# EAGLE design nextflex (EAGLE 9.5.2)

## Sheet 1 of 3
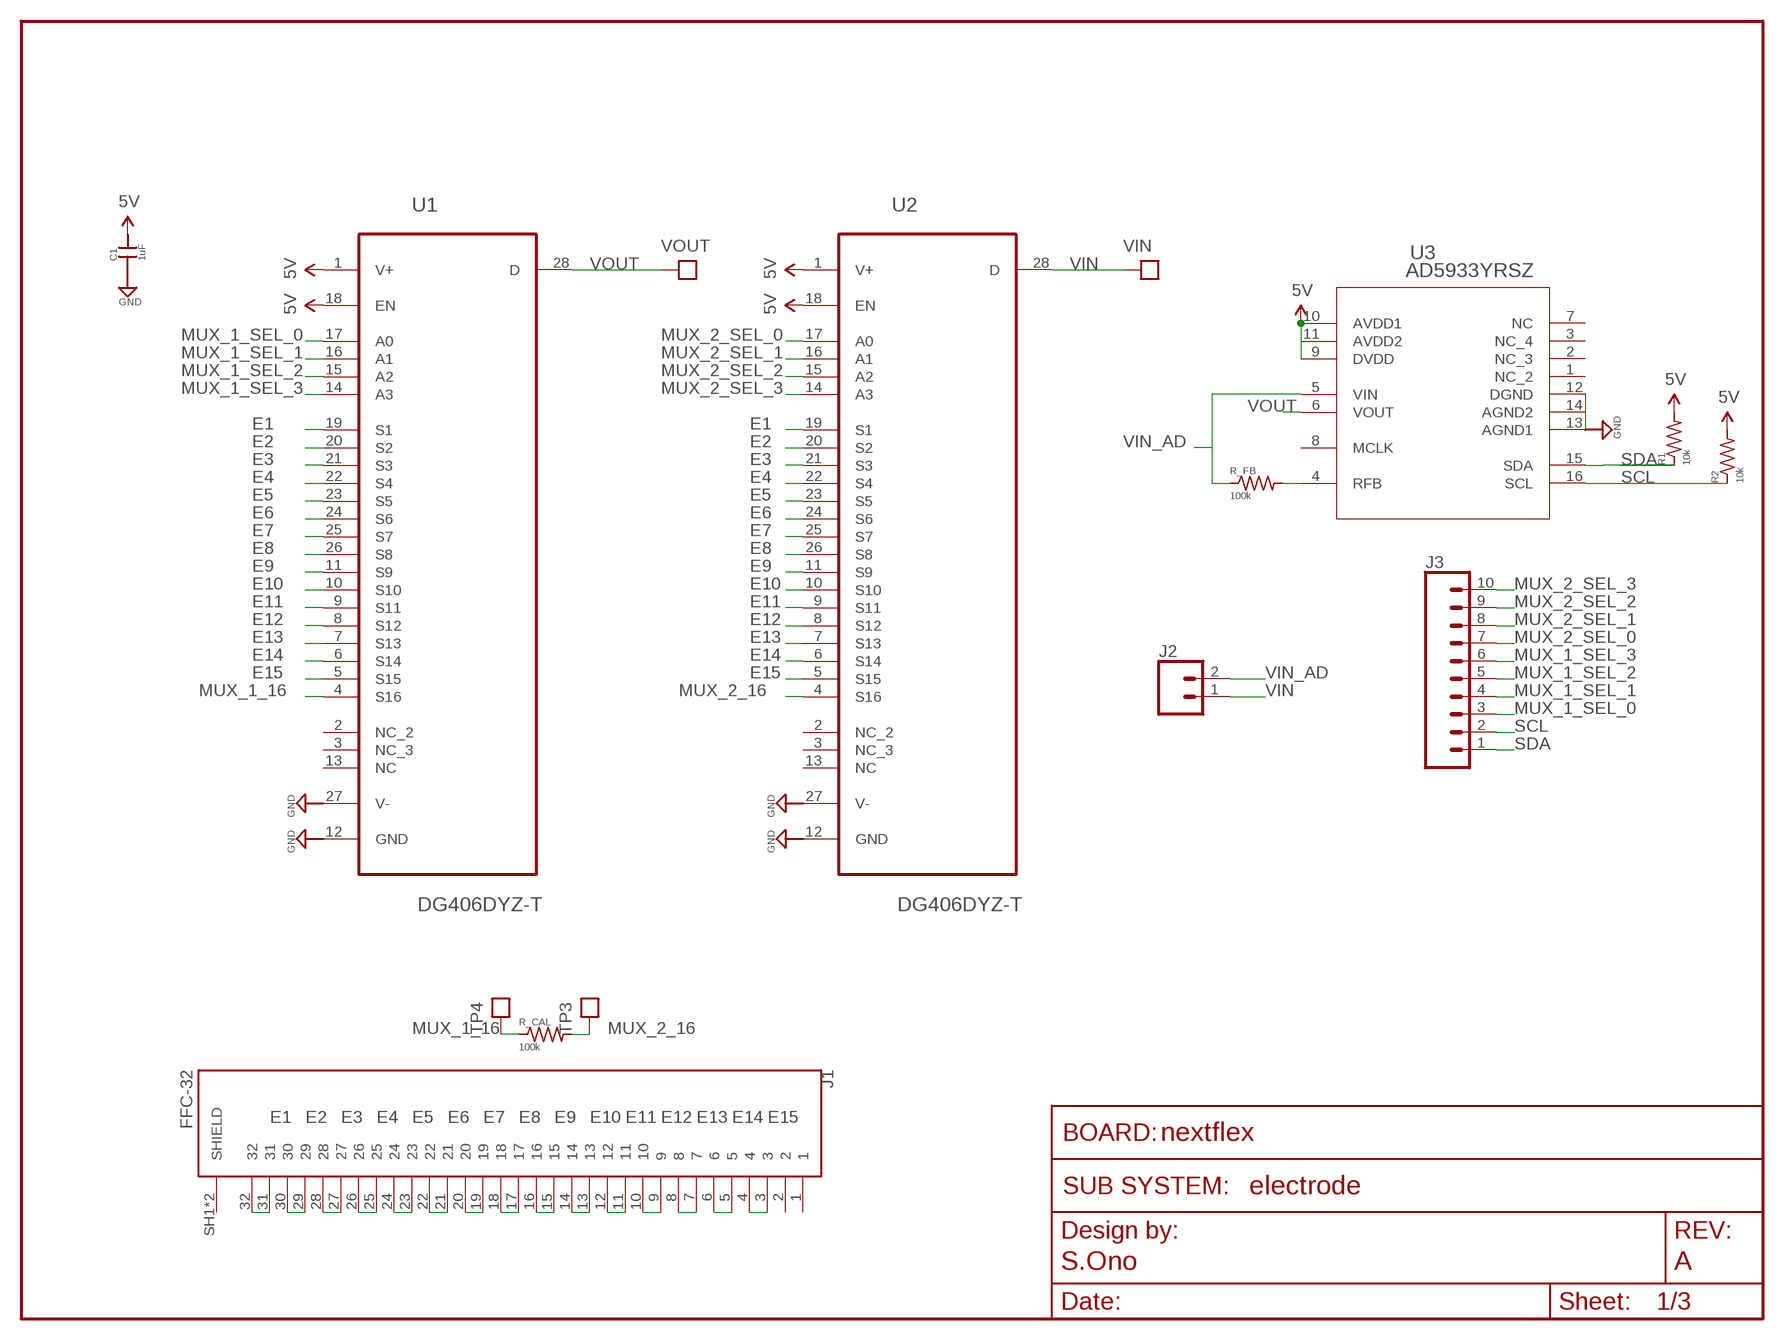
[diagram p0: schematic, sheet 1]
FRAME2 (FRAME_SCHEMATIC): AUTHOR: S.Ono; REV: A; SUBSYSTEM_NAME: electrode

### Parts
C1  1uF  CAP0603-CAP  [0603-CAP]
J1  FFC-32  [MOLEX_503480-3200]
J2  CONN_02  [1X02]
J3  CONN_10"  [1X10]
R1  10k  R-US_0603  [0603-RES]
R2  10k  R-US_0603  [0603-RES]
R_CAL  100k  R-US_0603  [0603-RES]
R_FB  100k  R-US_0603  [0603-RES]
TP3  TEST_POINTTHRU  [TEST_POINT]
TP4  TEST_POINTTHRU  [TEST_POINT]
U1  DG406DYZ-T  [SOIC127P1032X265-28N]
U2  DG406DYZ-T  [SOIC127P1032X265-28N]
U3  AD5933YRSZ  [RS_16]
VIN  TEST_POINTTHRU  [TEST_POINT]
VOUT  TEST_POINTTHRU  [TEST_POINT]

### Nets
5V [pwr]: C1.2 R1.2 R2.2 U1.1(V+) U1.18(EN) U2.1(V+) U2.18(EN) U3.9(DVDD) U3.10(AVDD1) U3.11(AVDD2) ; also sheet 2,3
E1: J1.31 J1.32 U1.19(S1) U2.19(S1)
E2: J1.29 J1.30 U1.20(S2) U2.20(S2)
E3: J1.27 J1.28 U1.21(S3) U2.21(S3)
E4: J1.25 J1.26 U1.22(S4) U2.22(S4)
E5: J1.23 J1.24 U1.23(S5) U2.23(S5)
E6: J1.21 J1.22 U1.24(S6) U2.24(S6)
E7: J1.19 J1.20 U1.25(S7) U2.25(S7)
E8: J1.17 J1.18 U1.26(S8) U2.26(S8)
E9: J1.15 J1.16 U1.11(S9) U2.11(S9)
E10: J1.13 J1.14 U1.10(S10) U2.10(S10)
E11: J1.11 J1.12 U1.9(S11) U2.9(S11)
E12: J1.9 J1.10 U1.8(S12) U2.8(S12)
E13: J1.7 J1.8 U1.7(S13) U2.7(S13)
E14: J1.5 J1.6 U1.6(S14) U2.6(S14)
E15: J1.3 J1.4 U1.5(S15) U2.5(S15)
GND: C1.1 U1.12(GND) U1.27(V-) U2.12(GND) U2.27(V-) U3.12(DGND) U3.13(AGND1) U3.14(AGND2) ; also sheet 2,3
MUX_1_16: R_CAL.1 TP4.1 U1.4(S16)
MUX_1_SEL_0: J3.3 U1.17(A0)
MUX_1_SEL_1: J3.4 U1.16(A1)
MUX_1_SEL_2: J3.5 U1.15(A2)
MUX_1_SEL_3: J3.6 U1.14(A3)
MUX_2_16: R_CAL.2 TP3.1 U2.4(S16)
MUX_2_SEL_0: J3.7 U2.17(A0)
MUX_2_SEL_1: J3.8 U2.16(A1)
MUX_2_SEL_2: J3.9 U2.15(A2)
MUX_2_SEL_3: J3.10 U2.14(A3)
N$3: R_FB.2 U3.4(RFB)
SCL: J3.2 R2.1 U3.16(SCL)
SDA: J3.1 R1.1 U3.15(SDA)
VIN: J2.1 U2.28(D) VIN.1
VIN_AD: J2.2 R_FB.1 U3.5(VIN)
VOUT: U1.28(D) U3.6(VOUT) VOUT.1
Unconnected: J1.1 J1.2 J1.SH1(SHIELD) J1.SH2(SHIELD) U1.2(NC_2) U1.3(NC_3) U1.13(NC) U2.2(NC_2) U2.3(NC_3) U2.13(NC) U3.1(NC_2) U3.2(NC_3) U3.3(NC_4) U3.7(NC) U3.8(MCLK)

## Sheet 2 of 3
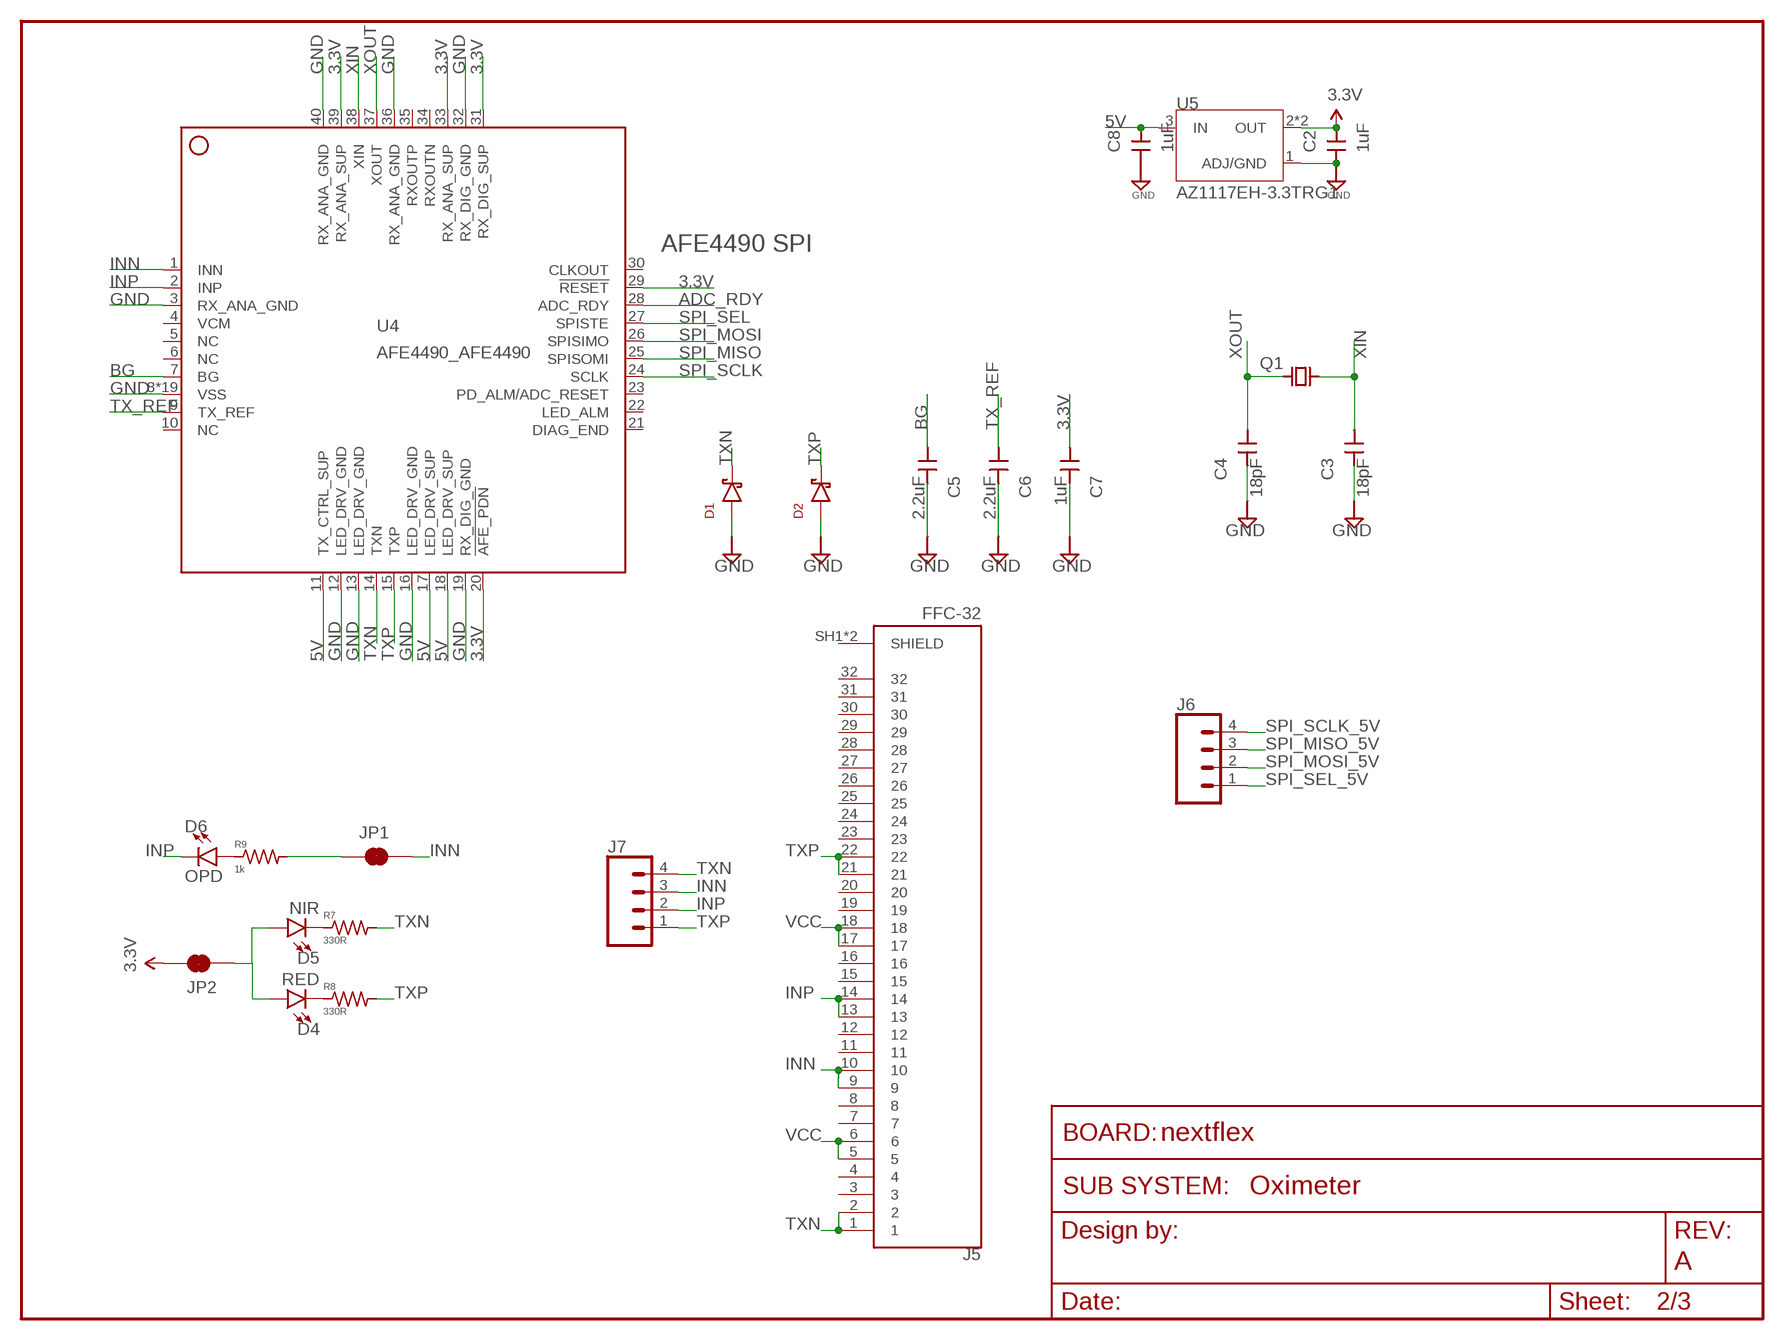
[diagram p1: schematic, sheet 2]
FRAME3 (FRAME_SCHEMATIC): AUTHOR: S.Ono; REV: A; SUBSYSTEM_NAME: Oximeter

### Parts
C2  1uF  CAP0603-CAP  [0603-CAP]
C3  18pF  CAP0603-CAP  [0603-CAP]
C4  18pF  CAP0603-CAP  [0603-CAP]
C5  2.2uF  CAP0603-CAP  [0603-CAP]
C6  2.2uF  CAP0603-CAP  [0603-CAP]
C7  1uF  CAP0603-CAP  [0603-CAP]
C8  1uF  CAP0603-CAP  [0603-CAP]
D1  DIODE_CZRU  [CZRU]
D2  DIODE_CZRU  [CZRU]
D4  RED  LED0603  [LED-0603]
D5  NIR  LED0603  [LED-0603]
D6  OPD  LED1206  [LED-1206]
J5  FFC-32  [MOLEX_503480-3200]
J6  CONN_04  [1X04]
J7  CONN_04  [1X04]
JP1  JUMPER-SMT_2_NC_TRACE_NO-SILK  [SMT-JUMPER_2_NC_TRACE_NO-SILK]
JP2  JUMPER-SMT_2_NC_TRACE_NO-SILK  [SMT-JUMPER_2_NC_TRACE_NO-SILK]
Q1  CRYSTAL_SMOL  [XTAL500X320X130N]
R7  330R  R-US_0603  [0603-RES]
R8  330R  R-US_0603  [0603-RES]
R9  1k  R-US_0603  [0603-RES]
U4  AFE4490_AFE4490  [AFE4490_QFN40-6X6]
U5  AZ1117EH-3.3TRG1  [SOT230P700X180-4N]

### Nets
3.3V [pwr]: C2.1 C7.1 JP2.2 U4.20(!AFE_PDN) U4.29(!RESET) U4.31(RX_DIG_SUP) U4.33(RX_ANA_SUP) U4.39(RX_ANA_SUP) U5.2(OUT) U5.4(OUT) ; also sheet 3
5V [pwr]: C8.1 U4.11(TX_CTRL_SUP) U4.17(LED_DRV_SUP) U4.18(LED_DRV_SUP) U5.3(IN) ; also sheet 1,3
ADC_RDY: U4.28(ADC_RDY)
BG: C5.1 U4.7(BG)
GND: C2.2 C3.2 C4.2 C5.2 C6.2 C7.2 C8.2 D1.P D2.P U4.3(RX_ANA_GND) U4.8(VSS) U4.12(LED_DRV_GND) U4.13(LED_DRV_GND) U4.16(LED_DRV_GND) U4.19(RX_DIG_GND) U4.32(RX_DIG_GND) U4.36(RX_ANA_GND) U4.40(RX_ANA_GND) U4.EXP@1(VSS) U4.EXP@2(VSS) U4.EXP@3(VSS) U4.EXP@4(VSS) U4.EXP@5(VSS) U4.EXP@6(VSS) U4.EXP@7(VSS) U4.EXP@8(VSS) U4.EXP@9(VSS) U4.EXP@10(VSS) U4.EXP@11(VSS) U4.EXP@12(VSS) U4.EXP@13(VSS) U4.EXP@14(VSS) U4.EXP@15(VSS) U4.EXP@16(VSS) U4.PWR@1(VSS) U4.PWR@2(VSS) U5.1(ADJ/GND) ; also sheet 1,3
INN: J5.9 J5.10 J7.3 JP1.2 U4.1(INN)
INP: D6.C J5.13 J5.14 J7.2 U4.2(INP)
N$16: D4.A D5.A JP2.1
N$17: D5.C R7.1
N$18: D4.C R8.1
N$19: D6.A R9.1
N$20: JP1.1 R9.2
SPI_MISO: U4.25(SPISOMI) ; also sheet 3
SPI_MISO_5V: J6.3 ; also sheet 3
SPI_MOSI: U4.26(SPISIMO) ; also sheet 3
SPI_MOSI_5V: J6.2 ; also sheet 3
SPI_SCLK: U4.24(SCLK) ; also sheet 3
SPI_SCLK_5V: J6.4 ; also sheet 3
SPI_SEL: U4.27(SPISTE) ; also sheet 3
SPI_SEL_5V: J6.1 ; also sheet 3
TX_REF: C6.1 U4.9(TX_REF)
TXN: D1.N J5.1 J5.2 J7.4 R7.2 U4.14(TXN)
TXP: D2.N J5.21 J5.22 J7.1 R8.2 U4.15(TXP)
VCC [pwr]: J5.5 J5.6 J5.17 J5.18 ; also sheet 3
XIN: C3.1 Q1.1(A) U4.38(XIN)
XOUT: C4.1 Q1.2(B) U4.37(XOUT)
Unconnected: J5.3 J5.4 J5.7 J5.8 J5.11 J5.12 J5.15 J5.16 J5.19 J5.20 J5.23 J5.24 J5.25 J5.26 J5.27 J5.28 J5.29 J5.30 J5.31 J5.32 J5.SH1(SHIELD) J5.SH2(SHIELD) U4.4(VCM) U4.5(NC) U4.6(NC) U4.10(NC) U4.21(DIAG_END) U4.22(LED_ALM) U4.23(PD_ALM/ADC_RESET) U4.30(CLKOUT) U4.34(RXOUTN) U4.35(RXOUTP)

### Notes on the sheet
- AFE4490 SPI

## Sheet 3 of 3
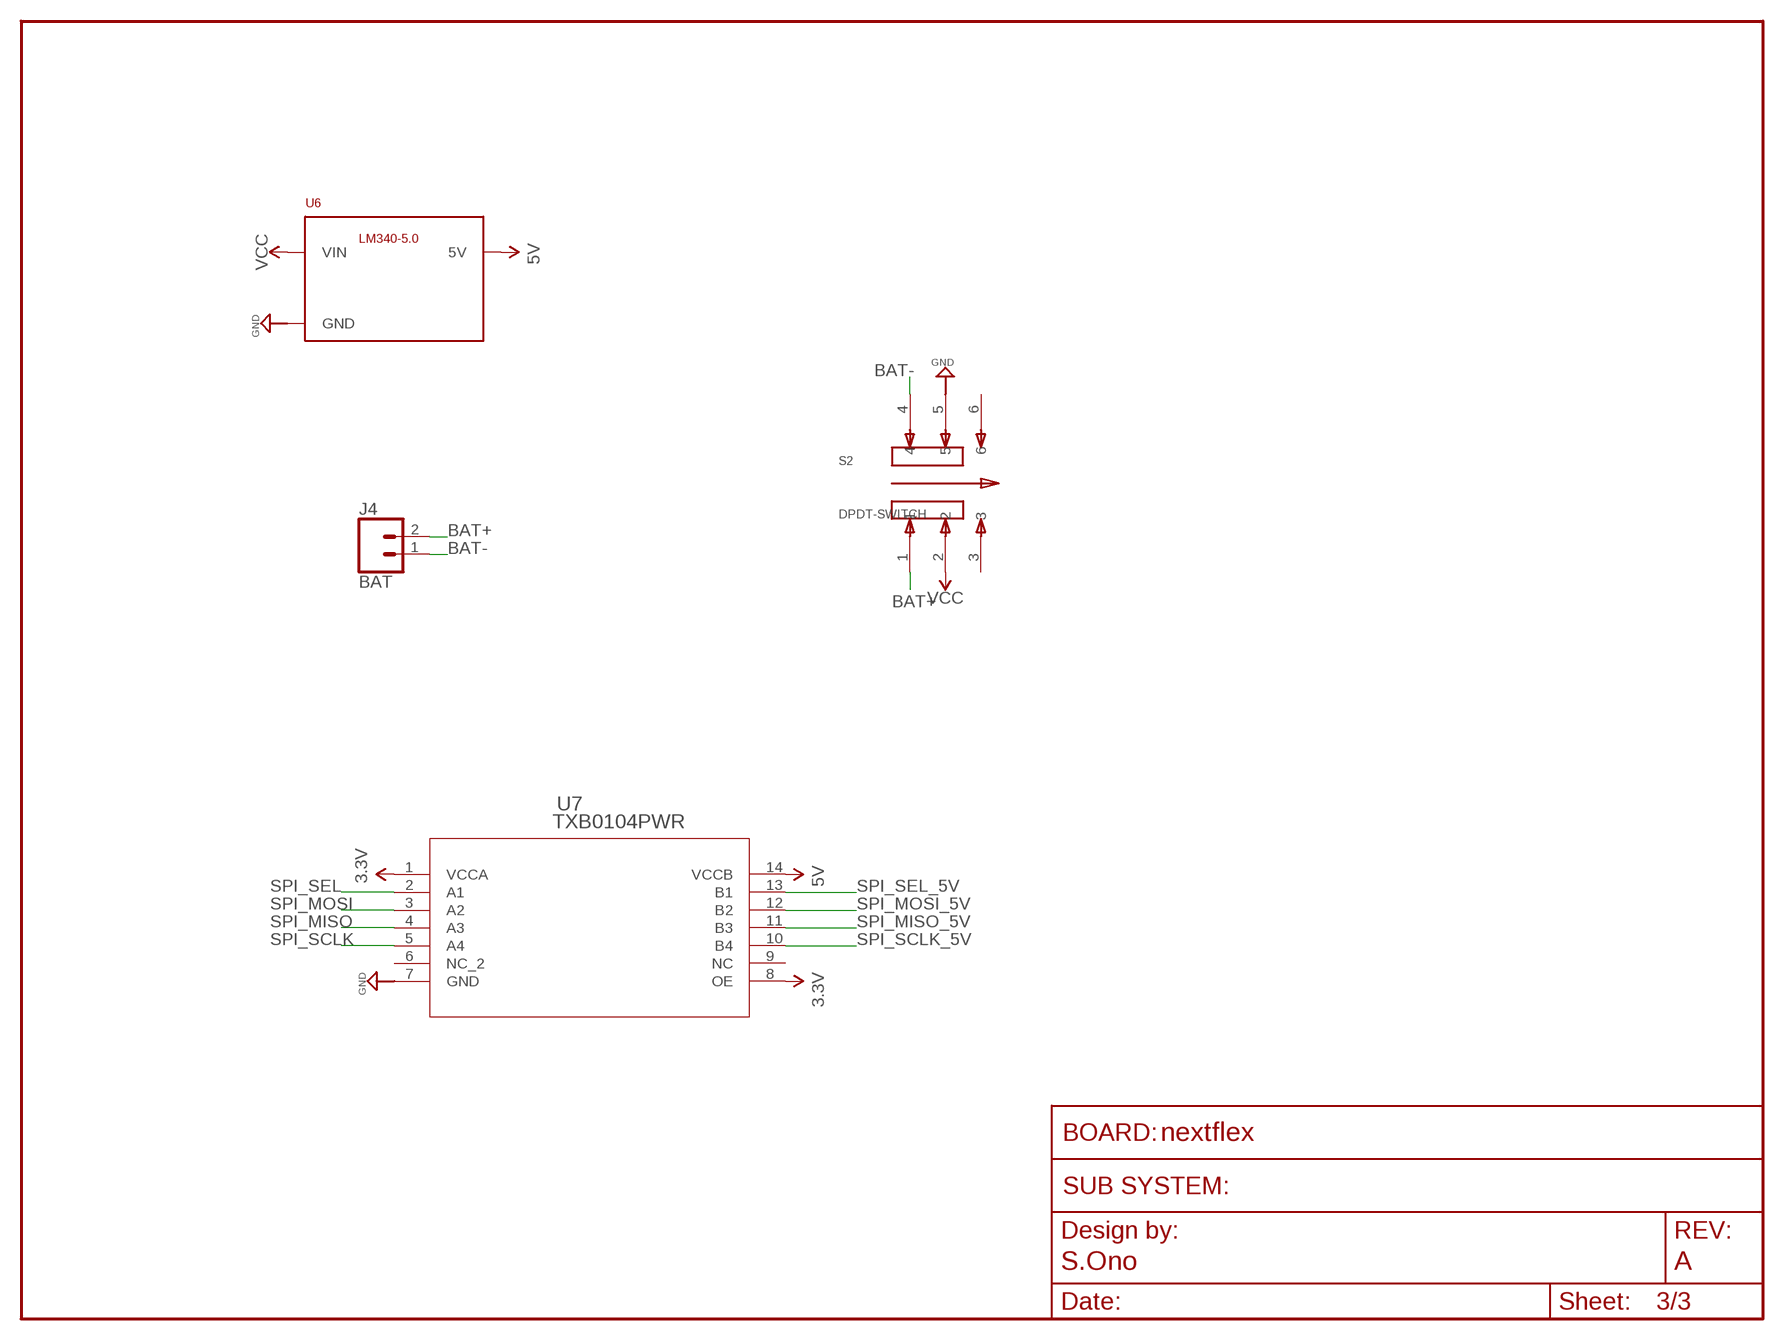
[diagram p2: schematic, sheet 3]
FRAME1 (FRAME_SCHEMATIC): AUTHOR: S.Ono; REV: A; SUBSYSTEM_NAME: power+uC

### Parts
J4  BAT  CONN_02  [1X02]
S2  DPDT-SWITCH  [SW_JS202011SCQN]
U6  LM340MPX-5.0230  [SOT230P700X180-4N]
U7  TXB0104PWR  [PW14]

### Nets
3.3V [pwr]: U7.1(VCCA) U7.8(OE) ; also sheet 2
5V [pwr]: U6.3(5V) U7.14(VCCB) ; also sheet 1,2
BAT+ [pwr]: J4.2 S2.1
BAT- [pwr]: J4.1 S2.4
GND: S2.5 U6.2(GND) U6.4(GND) U7.7(GND) ; also sheet 1,2
SPI_MISO: U7.4(A3) ; also sheet 2
SPI_MISO_5V: U7.11(B3) ; also sheet 2
SPI_MOSI: U7.3(A2) ; also sheet 2
SPI_MOSI_5V: U7.12(B2) ; also sheet 2
SPI_SCLK: U7.5(A4) ; also sheet 2
SPI_SCLK_5V: U7.10(B4) ; also sheet 2
SPI_SEL: U7.2(A1) ; also sheet 2
SPI_SEL_5V: U7.13(B1) ; also sheet 2
VCC [pwr]: S2.2 U6.1(VIN) ; also sheet 2
Unconnected: S2.3 S2.6 U7.6(NC_2) U7.9(NC)

## Library data of the parts
C1-C8 = scono:CAP: Capacitor Standard 0603 ceramic capacitor, and 0.1" leaded capacitor.; PIE-INT-REF-NUM: CAPACITOR-GENERIC
D1 D2 = scono:DIODE: Diodes - Power Rectification 20V: https://www.digikey.com/product-detail/en/panasonic-electronic-components/DB2S31600L/DB2S31600LCT-ND/2326097 20A: https://www.digikey.com/product-detail/en/on-semiconductor/FSV20100V/FSV20100VCT-ND/5306682
D4 D5 = scono:LED: https://www.digikey.com/products/en/optoelectronics/led-indication-discrete/105?k=&pkeyword=&pv7=2&pv1989=0&pv16=5&FV=ffe00069&quantity=0&ColumnSort=0&page=1&pageSize=25
D6 = scono:LED: https://www.digikey.com/products/en/optoelectronics/led-indication-discrete/105?k=&pkeyword=&pv7=2&pv1989=0&pv16=5&FV=ffe00069&quantity=0&ColumnSort=0&page=1&pageSize=25; PROD_ID: DIO-00862; VALUE: GREEN
J1 J5 = scono:FFC-32: 0.50mm Pitch Easy-On™ BackFlip™ Type FPC Connector, 1.00mm Height, Right Angle, SMT, Dual Contact Style, 32 Circuits; DESCRIPTION: 0.50mm Pitch Easy-On™ BackFlip™ Type FPC Connector, 1.00mm Height, Right Angle, Surface Mount, Dual Contact Style, 32...; DIGI-KEY_PART_NUMBER: WM11115CT-ND; DIGI-KEY_PURCHASE_URL: https://www.digikey.com/product-detail/en/molex/5034803200/WM11115CT-ND/5171273?utm_source=snapeda&utm_medium=aggregator&utm_campaign=symbol; MF: Molex; MP: 5034803200; PACKAGE: None
J2 J4 = scono:CONN_02: Multi connection point. Often used as Generic Header-pin footprint for 0.1 inch spaced/style header connections On any of the 0.1 inch spaced packages, you can populate with these: Break Away Headers - Straight <https://www.sparkfun.com/products/116> (PRT-00116) Break Away Male Headers - Right Angle <https://www.sparkfun.com/products/553> (PRT-00553) Female Headers <https://www.sparkfun.com/products/115> (PRT-00115) Break Away Headers - Machine Pin <https://www.sparkfun.com/products/117> (PRT-00117) Break Away Female Headers - Swiss Machine Pin <https://www.sparkfun.com/products/743> (PRT-00743) For SCREWTERMINALS and SPRING TERMINALS visit here: Screw Terimnals on SparkFun.com <https://www.sparkfun.com/search/results?term=Screw+Terminals> (5mm/3.5mm/2.54mm spacing) This device is also useful as a general connection point to wire up your design to another part of your project. Our various solder wires solder well into these plated through hole pads. Hook-Up Wire - Assortment (Stranded, 22 AWG) <https://www.sparkfun.com/products/11375> (PRT-11375) Hook-Up Wire - Assortment (Solid Core, 22 AWG) <https://www.sparkfun.com/products/11367> (PRT-11367) View the entire wire category on our website here <https://www.sparkfun.com/categories/141> Special notes: Molex polarized connector foot print use with: PRT-08233 with associated crimp pins and housings. 2.54_SCREWTERM for use with PRT-10571. 3.5mm Screw Terminal footprints for PRT-08084 5mm Screw Terminal footprints for use with PRT-08432
J3 = scono:CONN_10: Multi connection point. Often used as Generic Header-pin footprint for 0.1 inch spaced/style header connections On any of the 0.1 inch spaced packages, you can populate with these: Break Away Headers - Straight <https://www.sparkfun.com/products/116> (PRT-00116) Break Away Male Headers - Right Angle <https://www.sparkfun.com/products/553> (PRT-00553) Female Headers <https://www.sparkfun.com/products/115> (PRT-00115) Break Away Headers - Machine Pin <https://www.sparkfun.com/products/117> (PRT-00117) Break Away Female Headers - Swiss Machine Pin <https://www.sparkfun.com/products/743> (PRT-00743) Arduino Stackable Header - 10 Pin <https://www.sparkfun.com/products/11376> (PRT-11376) For SCREWTERMINALS and SPRING TERMINALS visit here: Screw Terimnals on SparkFun.com <https://www.sparkfun.com/search/results?term=Screw+Terminals> (5mm/3.5mm/2.54mm spacing) This device is also useful as a general connection point to wire up your design to another part of your project. Our various solder wires solder well into these plated through hole pads. Hook-Up Wire - Assortment (Stranded, 22 AWG) <https://www.sparkfun.com/products/11375> (PRT-11375) Hook-Up Wire - Assortment (Solid Core, 22 AWG) <https://www.sparkfun.com/products/11367> (PRT-11367) View the entire wire category on our website here <https://www.sparkfun.com/categories/141> Special notes: Molex polarized connector foot print use with SKU : PRT-08231 with associated crimp pins and housings. 1MM SMD Version SKU: PRT-10208 NOTES ON THE VARIANTS LOCK and LOCK_LONGPADS... This footprint was designed to help hold the alignment of a through-hole component (i.e. 6-pin header) while soldering it into place. You may notice that each hole has been shifted either up or down by 0.005 of an inch from it's more standard position (which is a perfectly straight line). This slight alteration caused the pins (the squares in the middle) to touch the edges of the holes. Because they are alternating, it causes a "brace" to hold the component in place. 0.005 has proven to be the perfect amount of "off-center" position when using our standard breakaway headers. Although looks a little odd when you look at the bare footprint, once you have a header in there, the alteration is very hard to notice. Also,if you push a header all the way into place, it is covered up entirely on the bottom side.; PROD_ID: CONN-11563
J6 J7 = scono:CONN_04: Multi connection point. Often used as Generic Header-pin footprint for 0.1 inch spaced/style header connections On any of the 0.1 inch spaced packages, you can populate with these: Break Away Headers - Straight <https://www.sparkfun.com/products/116> (PRT-00116) Break Away Male Headers - Right Angle <https://www.sparkfun.com/products/553> (PRT-00553) Female Headers <https://www.sparkfun.com/products/115> (PRT-00115) Break Away Headers - Machine Pin <https://www.sparkfun.com/products/117> (PRT-00117) Break Away Female Headers - Swiss Machine Pin <https://www.sparkfun.com/products/743> (PRT-00743) For SCREWTERMINALS and SPRING TERMINALS visit here: Screw Terimnals on SparkFun.com <https://www.sparkfun.com/search/results?term=Screw+Terminals> (5mm/3.5mm/2.54mm spacing) This device is also useful as a general connection point to wire up your design to another part of your project. Our various solder wires solder well into these plated through hole pads. Hook-Up Wire - Assortment (Stranded, 22 AWG) <https://www.sparkfun.com/products/11375> (PRT-11375) Hook-Up Wire - Assortment (Solid Core, 22 AWG) <https://www.sparkfun.com/products/11367> (PRT-11367) View the entire wire category on our website here <https://www.sparkfun.com/categories/141> Special notes: Molex polarized connector foot print use with SKU : PRT-08231 with associated crimp pins and housings. 1MM SMD Version SKU: PRT-10208; PROD_ID: CONN-09696
JP1 JP2 = scono:JUMPER-SMT_2_NC_TRACE: Normally closed trace jumper This jumper has a trace between two pads so it's normally closed (NC). Use a razor knife to open the connection. For best results follow the IPC guidelines for cutting traces: Cutout at least 0.063 mm (0.005 in). Remove all loose material to clean up the cut area. Seal the cut with an approved epoxy. Reapply solder to reclose the connection.
Q1 = scono:CRYSTAL
R1 R2 R7-R9 R_CAL R_FB = scono:R-US_: RESISTOR, American symbol
S2 = scono:DPDT-SWITCH: JS Series DPDT On-On Gull Wing Surface Mount Subminiature Slide Switch; DESCRIPTION: JS Series DPDT On-On Gull Wing Surface Mount Subminiature Slide Switch; DIGI-KEY_PART_NUMBER: 401-2002-1-ND; DIGI-KEY_PURCHASE_URL: https://www.digikey.com/product-detail/en/c-k/JS202011SCQN/401-2002-1-ND/1640098?utm_source=snapeda&utm_medium=aggregator&utm_campaign=symbol; MF: C&K; MP: JS202011SCQN; PACKAGE: None
TP3 TP4 VIN VOUT = scono:TEST_POINT: 1206 Test point for O-scope probes. For A106146CT-ND or similar
U1 U2 = scono:DG406DYZ-T: Single 16-Channel/Differential 8-Channel CMOS Analog Multiplexers; DESCRIPTION: DG406 Series 16 Channel _1 x 16: 1_ 50 Ohm CMOS Analog Multiplexer - SOIC-28; DIGI-KEY_PART_NUMBER: DG406DYZ-TCT-ND; DIGI-KEY_PURCHASE_URL: https://www.digikey.com/product-detail/en/renesas-electronics-america-inc/DG406DYZ-T/DG406DYZ-TCT-ND/3603194?utm_source=snapeda&utm_medium=aggregator&utm_campaign=symbol; MF: Renesas Electronics; MP: DG406DYZ-T; PACKAGE: SOIC-28 Intersil
U3 = scono:AD5933YRSZ: https://www.digikey.com/product-detail/en/AD5933YRSZ/AD5933YRSZ-ND/756602?utm_campaign=buynow&WT.z_cid=ref_octopart_dkc_buynow&utm_medium=aggregator&curr=usd&site=us&utm_source=octopart; MANUFACTURER_PART_NUMBER: AD5933YRSZ; VENDOR: Analog Devices Inc
U4 = scono:AFE4490_AFE4490
U5 = scono:AZ1117EH-3.3TRG1: 3.3V 3.3 Reglator Linear; DESCRIPTION: Ldo.Vreg Pos 3, 3v 1a Sot223; DIGI-KEY_PART_NUMBER: AZ1117EH-3.3TRG1DICT-ND; DIGI-KEY_PURCHASE_URL: https://www.digikey.com/product-detail/en/diodes-incorporated/AZ1117EH-3.3TRG1/AZ1117EH-3.3TRG1DICT-ND/5001336?utm_source=snapeda&utm_medium=aggregator&utm_campaign=symbol; MF: Diodes Inc.; MP: AZ1117EH-3.3TRG1; PACKAGE: SOT-223 Diodes Inc.
U6 = scono:LM340MPX-5.0
U7 = scono:TXB0104PWR; MANUFACTURER_PART_NUMBER: TXB0104PWR; VENDOR: Texas Instruments

## Net classes
0 default: width 0.152 mm, drill 0.39 mm, clearance 0.152 mm
1 pwr: width 0.254 mm, drill 0.4 mm, clearance 0.152 mm to class 0, clearance 0.152 mm

## Board
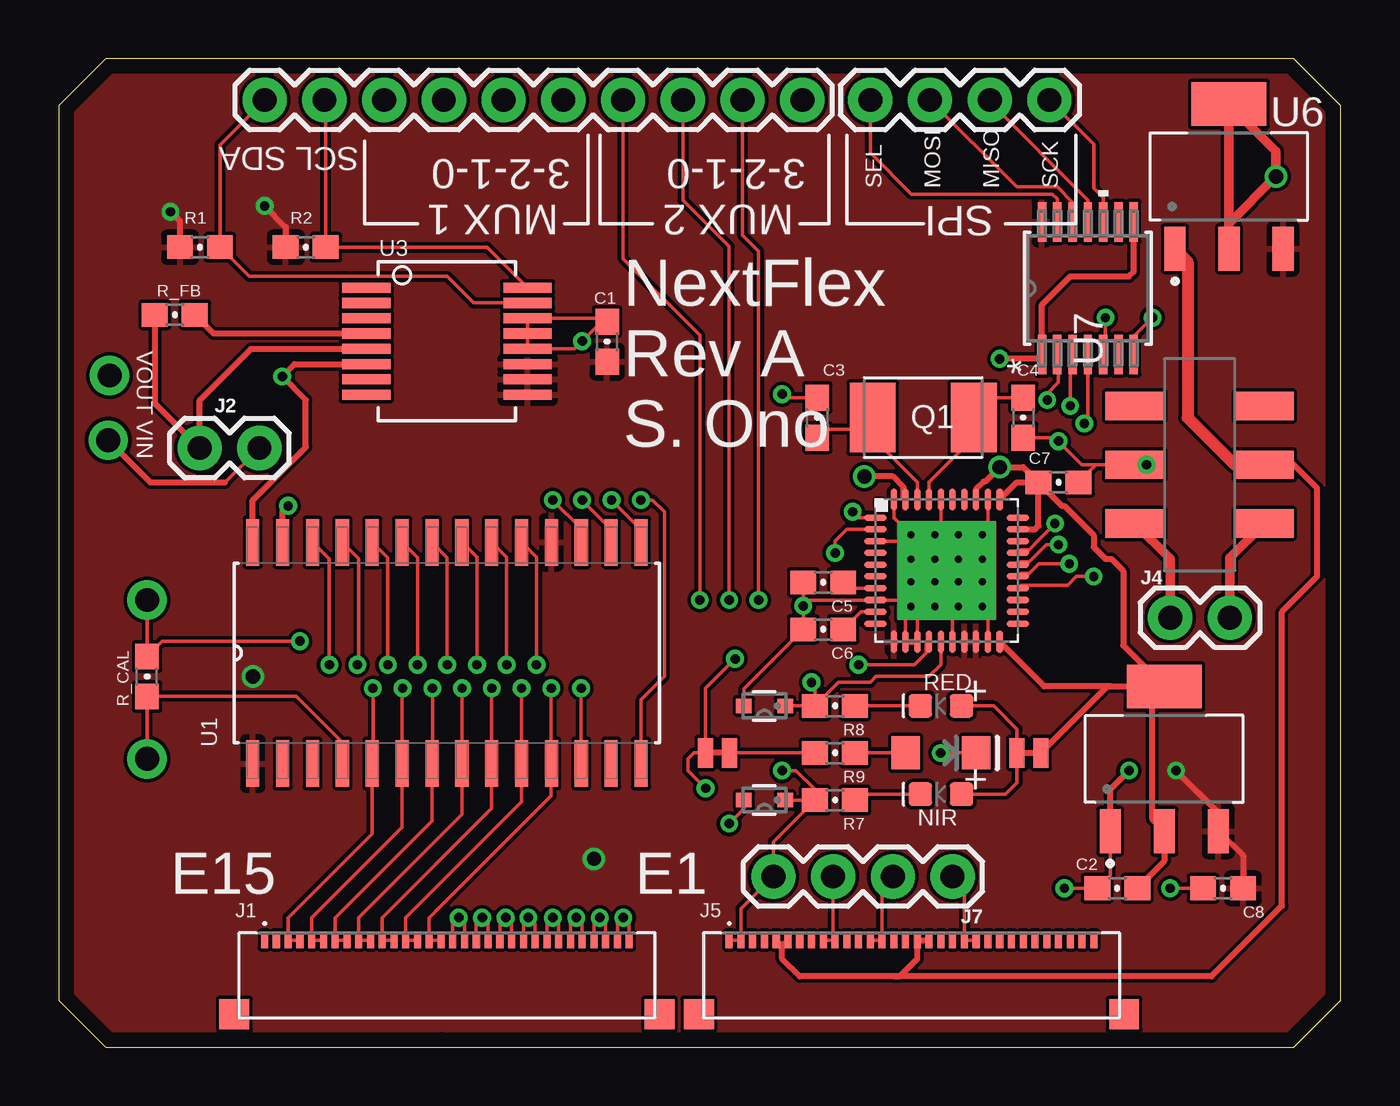
[diagram p3: board, top side]
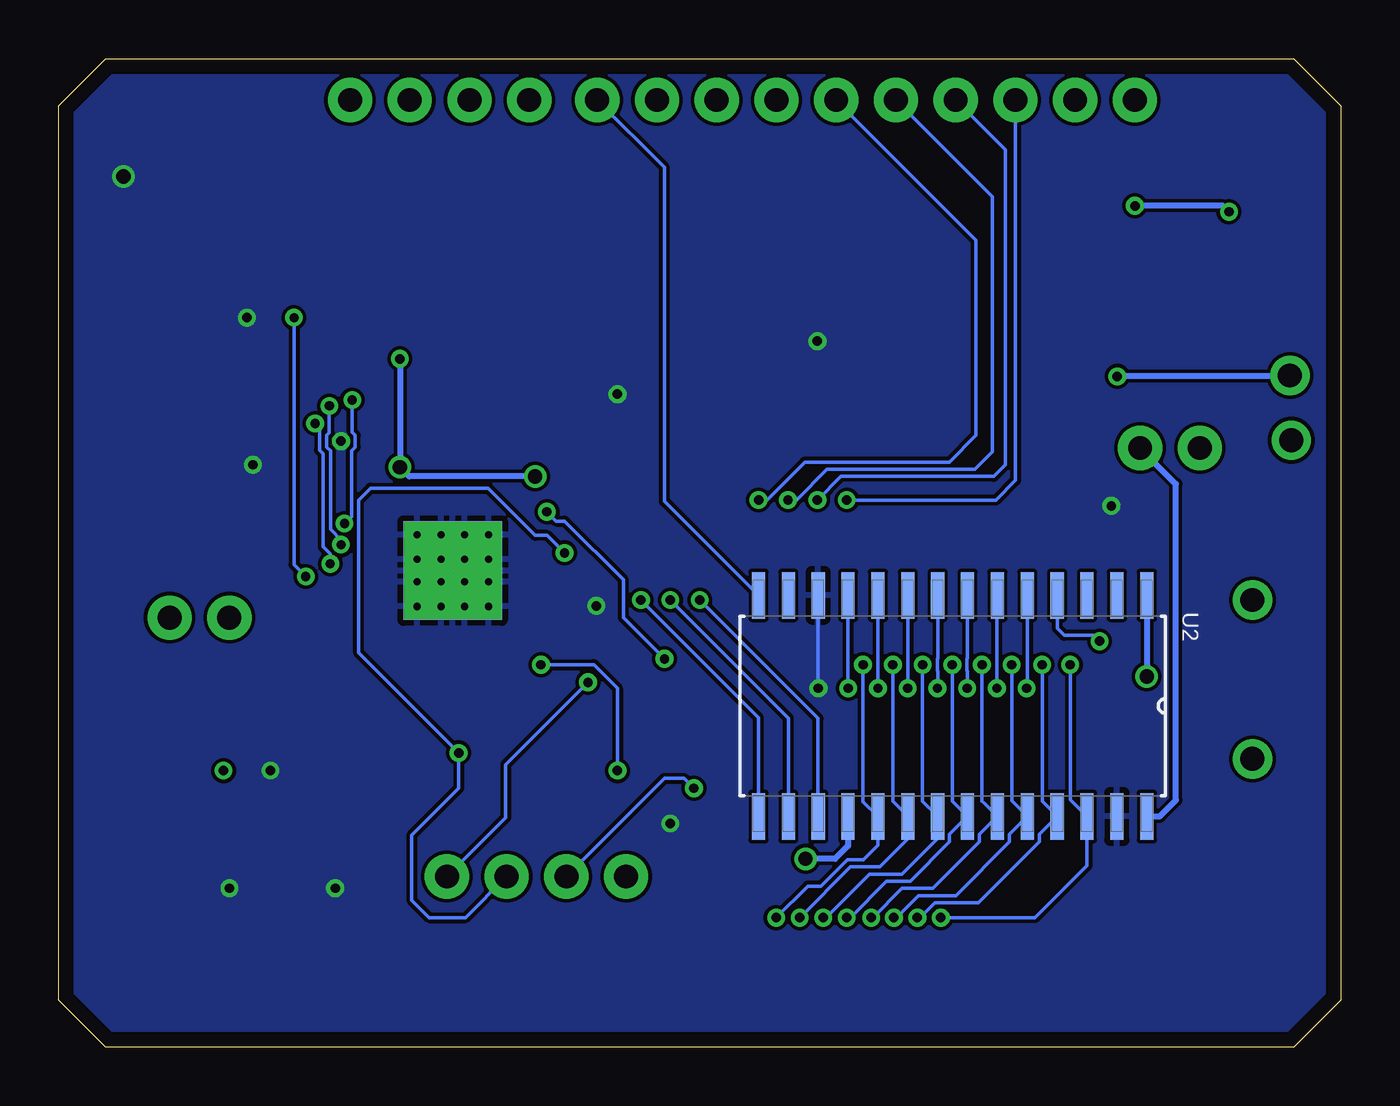
[diagram p4: board, bottom side, seen from below]

Size 54.5 x 42 mm. Coordinates in mm from the lower left corner, seen from the top.
Outline: 0,2 2,0 16.25,0 52.5,0 54.5,2 54.5,40 52.5,42 2,42 0,40 0,2
Copper layers (1*16): Top 2mil / dielectric 9mil / Bottom 2mil
Design rules "scono": minimum track width 6mil, minimum drill 15mil, track to track 6mil, track to pad 6mil, pad to pad 6mil, via to via 6mil, smd to smd 6mil, copper to edge 25mil, drill to drill 7mil, minimum pad ring 7mil, minimum via ring 7mil, stop-mask expansion 3mil, vias tented up to drill 0mil, thermal gap 10mil

### Footprints (pad centres in the part's own frame; a part is rotated, then mirrored left to right if it is on the bottom)
0603-CAP = smd 1.1 x 1: 1 -0.85,0; 2 0.85,0
CZRU = smd 0.66 x 0.61: N -0.876,0; P 0.876,0
LED-0603 = smd 1 x 1: A -0.877,0; C 0.877,0
LED-1206 = smd 1.2 x 1.4: A -1.5,0; C 1.5,0
MOLEX_503480-3200 = smd 0.3 x 0.7: 1 -7.75,1.8; 2 -7.25,1.8; 3 -6.75,1.8; 4 -6.25,1.8; 5 -5.75,1.8; 6 -5.25,1.8; 7 -4.75,1.8; 8 -4.25,1.8; 9 -3.75,1.8; 10 -3.25,1.8; 11 -2.75,1.8; 12 -2.25,1.8; 13 -1.75,1.8; 14 -1.25,1.8; 15 -0.75,1.8; 16 -0.25,1.8; 17 0.25,1.8; 18 0.75,1.8; 19 1.25,1.8; 20 1.75,1.8; 21 2.25,1.8; 22 2.75,1.8; 23 3.25,1.8; 24 3.75,1.8; 25 4.25,1.8; 26 4.75,1.8; 27 5.25,1.8; 28 5.75,1.8; 29 6.25,1.8; 30 6.75,1.8; 31 7.25,1.8; 32 7.75,1.8 | smd 1.27 x 1.27: SH1 -9.04,-1.35; SH2 9.04,-1.35
1X02 = drill 1.016 pad 1.88: 1 0,0; 2 2.54,0
1X10 = drill 1.016 pad 1.88: 1 0,0; 2 2.54,0; 3 5.08,0; 4 7.62,0; 5 10.16,0; 6 12.7,0; 7 15.24,0; 8 17.78,0; 9 20.32,0; 10 22.86,0
1X04 = drill 1.016 pad 1.88: 1 0,0; 2 2.54,0; 3 5.08,0; 4 7.62,0
SMT-JUMPER_2_NC_TRACE_NO-SILK = smd 0.635 x 1.27: 1 -0.508,0; 2 0.508,0
XTAL500X320X130N = smd 1.95 x 2.95: 1 -2.15,0; 2 2.15,0
0603-RES = smd 1.1 x 1: 1 -0.85,0; 2 0.85,0
SW_JS202011SCQN = smd 1.2 x 2.5: 1 -2.5,-2.75; 2 0,-2.75; 3 2.5,-2.75; 4 -2.5,2.75; 5 0,2.75; 6 2.5,2.75
TEST_POINT = drill 1.016 pad 1.676: 1 0,0
SOIC127P1032X265-28N = smd 1.981 x 0.559: 1 -4.699,8.255; 2 -4.699,6.985; 3 -4.699,5.715; 4 -4.699,4.445; 5 -4.699,3.175; 6 -4.699,1.905; 7 -4.699,0.635; 8 -4.699,-0.635; 9 -4.699,-1.905; 10 -4.699,-3.175; 11 -4.699,-4.445; 12 -4.699,-5.715; 13 -4.699,-6.985; 14 -4.699,-8.255; 15 4.699,-8.255; 16 4.699,-6.985; 17 4.699,-5.715; 18 4.699,-4.445; 19 4.699,-3.175; 20 4.699,-1.905; 21 4.699,-0.635; 22 4.699,0.635; 23 4.699,1.905; 24 4.699,3.175; 25 4.699,4.445; 26 4.699,5.715; 27 4.699,6.985; 28 4.699,8.255
RS_16 = smd 2.057 x 0.432: 1 -3.429,2.275; 2 -3.429,1.625; 3 -3.429,0.975; 4 -3.429,0.325; 5 -3.429,-0.325; 6 -3.429,-0.975; 7 -3.429,-1.625; 8 -3.429,-2.275; 9 3.429,-2.275; 10 3.429,-1.625; 11 3.429,-0.975; 12 3.429,-0.325; 13 3.429,0.325; 14 3.429,0.975; 15 3.429,1.625; 16 3.429,2.275
AFE4490_QFN40-6X6 = smd 0.95 x 0.28: 1 -3.025,2.25; 2 -3.025,1.75; 3 -3.025,1.25; 4 -3.025,0.75; 5 -3.025,0.25; 6 -3.025,-0.25; 7 -3.025,-0.75; 8 -3.025,-1.25; 9 -3.025,-1.75; 10 -3.025,-2.25; 21 3.025,-2.25; 22 3.025,-1.75; 23 3.025,-1.25; 24 3.025,-0.75; 25 3.025,-0.25; 26 3.025,0.25; 27 3.025,0.75; 28 3.025,1.25; 29 3.025,1.75; 30 3.025,2.25 | smd 0.28 x 0.95: 11 -2.25,-3.025; 12 -1.75,-3.025; 13 -1.25,-3.025; 14 -0.75,-3.025; 15 -0.25,-3.025; 16 0.25,-3.025; 17 0.75,-3.025; 18 1.25,-3.025; 19 1.75,-3.025; 20 2.25,-3.025; 31 2.25,3.025; 32 1.75,3.025; 33 1.25,3.025; 34 0.75,3.025; 35 0.25,3.025; 36 -0.25,3.025; 37 -0.75,3.025; 38 -1.25,3.025; 39 -1.75,3.025; 40 -2.25,3.025 | drill 0.3 pad 1.1 square: EXP@1 -1.525,1.525; EXP@2 -0.5,1.525; EXP@3 0.5,1.525; EXP@4 1.525,1.525; EXP@5 -1.525,0.475; EXP@6 -0.5,0.475; EXP@7 0.5,0.475; EXP@8 1.525,0.475; EXP@9 -1.525,-0.475; EXP@10 -0.5,-0.475; EXP@11 0.5,-0.475; EXP@12 1.525,-0.475; EXP@13 -1.525,-1.525; EXP@14 -0.5,-1.525; EXP@15 0.5,-1.525; EXP@16 1.525,-1.525 | smd 4.191 x 4.191 bottom: PWR@1 0,0 | smd 4.191 x 4.191: PWR@2 0,0
SOT230P700X180-4N = smd 1.86 x 0.9: 1 -3.075,2.3; 2 -3.075,0; 3 -3.075,-2.3 | smd 1.86 x 3.19: 4 3.075,0
PW14 = smd 1.676 x 0.356: 1 -2.819,1.95; 2 -2.819,1.3; 3 -2.819,0.65; 4 -2.819,0; 5 -2.819,-0.65; 6 -2.819,-1.3; 7 -2.819,-1.95; 8 2.819,-1.95; 9 2.819,-1.3; 10 2.819,-0.65; 11 2.819,0; 12 2.819,0.65; 13 2.819,1.3; 14 2.819,1.95

### Placement (x,y rotation side)
C1  23.31,29.98 270 top
C2  45,6.75 180 top
C3  32.25,26.75 90 top
C4  41,26.75 270 top
C5  32.5,19.75 180 top
C6  32.5,17.75 180 top
C7  42.5,24 0 top
C8  49.5,6.75 180 top
D1  30,10.5 180 top
D2  30,14.5 180 top
D4  37.5,14.5 180 top
D5  37.5,10.75 180 top
D6  37.5,12.5 0 top
J1  16.5,2.75 0 top
J2  8.53,25.46 180 top
J3  8.75,40.25 0 top
J4  47.25,18.25 0 top
J5  36.25,2.75 0 top
J6  34.5,40.25 0 top
J7  38,7.25 180 top
JP1  28,12.5 180 top
JP2  41.25,12.5 0 top
Q1  36.75,26.75 0 top
R1  6,34 180 top
R2  10.5,34 180 top
R7  33,10.5 180 top
R8  33,14.5 180 top
R9  33,12.5 180 top
R_CAL  3.75,15.75 90 top
R_FB  4.93,31.12 0 top
S2  48.5,24.75 90 top
TP3  3.75,19 180 top
TP4  3.75,12.25 180 top
U1  16.5,16.75 90 top
U2  16.5,14.5 270 bottom
U3  16.5,30 0 top
U4  37.75,20.25 0 top
U5  47,12.25 90 top
U6  49.75,37 90 top
U7  43.75,32.25 90 top
VIN  2.1,25.79 0 top
VOUT  2.16,28.54 0 top

### Tracks (layer width: path | path; a pad name or v marks a point on that pad's centre or on a via)
3.3V  (via drill 0.4, 0.6)
  Top 0.254: C2.1 47,7.9 U5.2 46.5,9.68 46.5,14.82 U5.4 | JP2.2 44.58,15.32 44.75,15.32 | 44.75,15.32 U5.4 | U4.31 40.73,24 C7.1 | 44.75,15.32 41.9,15.32 U4.20 | U4.29 41.5,22 41.65,22.15 C7.1 | U4.39 35.92,23.36 35.92,23.78 35.45,24.25 v34.25,24.25 | C7.1 41.01,24.64 v40,24.64 39.38,24.03 39.33,24.03 39,23.7 U4.33 | C7.1 42.65,23 42.75,23 44,21.75 44,21.25 44.5,20.75 44.75,20.75 45.25,20.25 45.25,17.07 U5.4 | v40,29.25 41.62,29.25 U7.1 41.8,31.55 43,32.75 45.5,32.75 45.7,32.95 U7.8
  Bottom 0.254: v34.25,24.25 39.6,24.25 v40,24.64 v40,29.25
5V  (via drill 0.4, 0.6)
  Top 0.254: U5.3 50.35,8.12 C8.1 | R1.2 5.15,35.1 v4.75,35.5 | v8.75,35.75 9.65,34.85 R2.2
  Top 0.256: v47.5,11.75 49.3,9.95 U5.3
  Bottom 0.254: U2.18 20.95,8.55 21.5,8 v22.75,8 | U2.1 v8.25,15.75 | v4.75,35.5 5,35.75 v8.75,35.75
  pour Top: -4,47.25 -4,-2 56,-2 56,47.25
BAT+
  Top 0.406: J4.2 49.79,20.79 S2.1
BAT-
  Top 0.406: S2.4 47.25,20.75 J4.1
BG
  Top 0.152: U4.7 33.6,19.5 C5.1
E1  (via drill 0.4)
  Top 0.152: U1.19 20.31,20.82 v20.31,16.25 | v24,5.5 23.75,5.25 | v24,5.5 24.25,5.25 | v24,5.5 24.25,5.25 | 24.25,5.25 J1.32 | v24,5.5 23.75,5.25 | 23.75,5.25 J1.31
  Bottom 0.152: v20.31,16.25 20.31,10.43 U2.19 19.68,8.57 20.29,7.96 20.97,7.96 22.09,6.84 22.66,6.84 v24,5.5
E2  (via drill 0.4)
  Top 0.152: U1.20 19.04,20.81 v19.04,16.25 | v23,5.5 23.25,5.25 J1.30 | v23,5.5 22.75,5.25 | v23,5.5 22.75,5.25 | 22.75,5.25 J1.29
  Bottom 0.152: v19.04,16.25 19.04,10.44 U2.20 18.41,8.85 19.59,7.66 20.84,7.66 v23,5.5
E3  (via drill 0.4)
  Top 0.152: U1.21 17.78,20.81 v17.78,16.25 | v22,5.5 21.75,5.25 | v22,5.5 22.25,5.25 | v22,5.5 22.25,5.25 | 22.25,5.25 J1.28 | v22,5.5 21.75,5.25 | 21.75,5.25 J1.27
  Bottom 0.152: v17.78,16.25 17.78,10.44 U2.21 17.14,8.87 18.65,7.35 20.04,7.35 21.89,5.5 v22,5.5
E4  (via drill 0.4)
  Top 0.152: U1.22 16.51,20.8 v16.51,16.25 | v21,5.5 20.75,5.25 | v21,5.5 21.25,5.25 | v21,5.5 21.25,5.25 | 21.25,5.25 J1.26 | v21,5.5 20.75,5.25 | 20.75,5.25 J1.25
  Bottom 0.152: v16.51,16.25 16.51,10.45 U2.22 16.63,9.04 16.63,8.72 18.3,7.05 19.31,7.05 20.85,5.5 v21,5.5
E5  (via drill 0.4)
  Top 0.152: U1.23 15.25,20.79 v15.25,16.25 | v19.96,5.5 19.75,5.29 | v19.96,5.5 20.25,5.21 J1.24 | v19.96,5.5 19.75,5.29 | 19.75,5.29 J1.23
  Bottom 0.152: 15.25,10.46 15.15,10.35 | 15.15,10.35 U2.23 15.36,9.04 15.36,8.72 17.33,6.74 18.65,6.74 19.89,5.5 v19.96,5.5 | v15.25,16.25 15.25,10.46 | 15.25,10.46 15.15,10.35
E6  (via drill 0.4)
  Top 0.152: v13.99,16.25 13.99,20.79 U1.24 | v19,5.5 19.25,5.25 | v19,5.5 18.75,5.25 J1.21 | v19,5.5 19.25,5.25 | 19.25,5.25 J1.22
  Bottom 0.152: v13.99,16.25 13.99,10.46 U2.24 14.09,9.04 14.09,8.72 16.37,6.44 17.96,6.44 18.89,5.5 v19,5.5
E7  (via drill 0.4)
  Top 0.152: U1.25 12.75,20.75 12.75,16.31 v12.69,16.25 | v18,5.5 17.75,5.25 | v18,5.5 18.25,5.25 J1.20 | v18,5.5 17.75,5.25 | 17.75,5.25 J1.19
  Bottom 0.152: v12.69,16.25 12.69,10.44 U2.25 12.82,9.04 12.82,8.72 15.4,6.13 17.26,6.13 17.89,5.5 v18,5.5
E8  (via drill 0.4)
  Top 0.152: U1.26 11.5,20.75 v11.5,16.25 | v17,5.5 16.75,5.25 | v17,5.5 17.25,5.25 | v17,5.5 17.25,5.25 | 17.25,5.25 J1.18 | v17,5.5 16.75,5.25 | 16.75,5.25 J1.17
  Bottom 0.152: v11.5,16.25 11.5,10.52 U2.26 10.79,7.71 13,5.5 v17,5.5
E9  (via drill 0.4)
  Top 0.152: v20.94,15.25 U1.11 | U1.11 | U1.11 20.94,10.69 15.75,5.5 J1.15 J1.16
  Bottom 0.152: U2.11 v20.95,15.26 v20.94,15.25
E10  (via drill 0.4)
  Top 0.152: v19.67,15.25 U1.10 | U1.10 | U1.10 19.67,10.42 14.75,5.5 J1.13 J1.14
  Bottom 0.152: U2.10 v19.68,15.25 v19.67,15.25
E11  (via drill 0.4)
  Top 0.152: v18.41,15.25 18.41,12.25 | 18.41,12.25 U1.9 | 18.41,12.25 18.41,10.16 13.75,5.5 J1.11 J1.12
  Bottom 0.152: v18.41,15.25 18.41,15.98 18.41,15.99 18.41,16.51 18.41,16.52 U2.9
E12  (via drill 0.4)
  Top 0.152: v17.14,15.25 U1.8 17.14,9.88 12.75,5.5 J1.9 J1.10
  Bottom 0.152: v17.14,15.25 17.14,15.26 17.14,15.98 17.14,15.99 17.14,16.51 17.14,16.52 U2.8
E13  (via drill 0.4)
  Top 0.152: v15.88,15.25 15.88,12.07 U1.7 15.87,9.62 11.75,5.5 J1.7 J1.8
  Bottom 0.152: v15.88,15.25 15.87,15.27 15.87,15.97 15.88,15.99 15.88,16.51 15.87,16.53 U2.7
E14  (via drill 0.4)
  Top 0.152: v14.62,15.25 14.6,15.23 U1.6 14.6,9.35 10.75,5.5 J1.5 J1.6
  Bottom 0.152: v14.62,15.25 14.62,19.18 U2.6
E15  (via drill 0.4)
  Top 0.152: v13.36,15.25 13.36,12.08 U1.5 13.32,9.07 9.75,5.5 J1.3 J1.4
  Bottom 0.152: U2.5 13.32,15.28 v13.36,15.25
GND  (via drill 0.4, 0.6)  (1 unrouted)
  Top 0.152: v22.21,15.25 U1.12 | C3.2 30.9,27.6 v30.75,27.75 | C4.2 42.35,25.9 v42.5,25.75 43.5,24.75 S2.5 | U4.32 39.5,22 U4.EXP@4 U4.PWR@2 | U4.36 37.5,22.02 U4.EXP@2 37.75,21.27 | U4.40 35.5,22.5 U4.EXP@1 | U4.3 35.95,21.5 U4.EXP@1 | U4.EXP@13 35.95,19 U4.8 31.9,19 v31.65,18.75 | U4.12 36,18.5 U4.EXP@13 | U4.13 36.5,18.45 U4.EXP@13 | U4.16 38,18.48 U4.EXP@15 37.75,19.23 U4.PWR@2 | U4.19 39.5,18.5 U4.EXP@16 U4.PWR@2 | U4.PWR@2 37.75,21.27 | 37.75,21.27 38.24,21.76 | 38.24,21.76 U4.EXP@3 | U4.PWR@2 37.75,21.27 | U4.PWR@2 U4.EXP@1 | U4.EXP@5 U4.EXP@6 37.27,20.73 U4.PWR@2 | U4.PWR@2 38.23,20.73 | 38.23,20.73 U4.EXP@7 | U4.PWR@2 38.23,20.73 | 38.23,20.73 U4.EXP@8 | U4.PWR@2 38.8,20.25 U4.EXP@12 | U4.PWR@2 37.77,20.25 U4.EXP@11 | U4.PWR@2 37.27,19.77 | 37.27,19.77 U4.EXP@10 | U4.PWR@2 37.27,19.77 | 37.27,19.77 U4.EXP@9 | U4.PWR@2 U4.EXP@13 | U4.PWR@2 37.25,19.75 U4.EXP@14 | U4.PWR@2 37.75,21.27 | 37.75,21.27 38.24,21.76 | 44.7,9.5 44.7,7.3 C2.2 v42.75,6.75 | D2.P 29.12,15.22 C6.2 v31.65,18.75 | v31.65,18.75 C5.2 | C7.2 44.1,24.75 S2.5 | C8.2 v47.25,6.75 | D1.P 29.12,10.12 v28.5,9.5 | 49.75,39.75 U6.4 | U7.7 45.7,30.2 v46.5,31 | S2.5 v46.25,24.75 | U3.12 U3.13 U3.14 23.16,30.98 C1.1 23.08,30.83 v22.25,30 21.93,29.68 U3.12
  Top 0.25: U5.1 44.7,9.5 44.7,10.95 v45.5,11.75
  Top 0.254: U4.12 U4.13
  Top 0.256: U1.27 9.52,22.77 v9.75,23
  Top 0.406: U6.4 51.75,38.08 v51.75,37 49.75,35 U6.2 49.75,39.75
  Bottom 0.152: U2.12 v22.21,15.26 v22.21,15.25
  pour Bottom: -4,47.25 -4,-2 56,-2 56,47.25
INN  (via drill 0.4)
  Top 0.152: U4.1 34,22.5 v33.75,22.75 | J5.9 J5.10 32.92,4.63 J7.3 | v27.5,11 26.75,11.75 26.75,12.25 27,12.5 JP1.2 27.49,15.24 v28.75,16.5
  Bottom 0.152: J7.3 28.75,11.42 27.92,11.42 v27.5,11 | v33.75,22.75 33.36,22.36 33,22.36 30.5,19.86 30.5,18.25 v28.75,16.5
INP  (via drill 0.4)
  Top 0.152: U4.2 33.5,22 33,21.5 v33,21 | D6.C v37.5,12.5 | J5.13 J5.14 35,6.79 J7.2
  Bottom 0.152: J7.2 37.21,5.5 38.75,5.5 39.5,6.25 39.5,9 37.5,11 v37.5,12.5 41.75,16.75 41.75,23.25 41.25,23.75 36.25,23.75 34.25,21.75 33.75,21.75 v33,21
MUX_1_16
  Top 0.152: TP4.1 3.75,14.75 R_CAL.1 10.1,14.9 12.05,12.95 U1.4
MUX_1_SEL_0  (via drill 0.4)
  Top 0.152: U1.17 22.21,22.04 v21,23.25
  Bottom 0.152: J3.3 13.83,24.08 14.66,23.25 v21,23.25
MUX_1_SEL_1  (via drill 0.4)
  Top 0.152: U1.16 23.48,22.02 v22.25,23.25
  Bottom 0.152: J3.4 14.25,38.13 14.25,24.75 14.75,24.25 21.25,24.25 v22.25,23.25
MUX_1_SEL_2  (via drill 0.4)
  Top 0.152: U1.15 24.75,22 v23.5,23.25
  Bottom 0.152: J3.5 14.8,36.15 14.8,25.3 15.55,24.55 21.84,24.55 23.14,23.25 v23.5,23.25
MUX_1_SEL_3  (via drill 0.4)
  Top 0.152: U1.14 24.75,14.76 25.75,15.75 25.75,22.75 25.25,23.25 v24.75,23.25
  Bottom 0.152: J3.6 15.5,34.3 15.5,26 16.64,24.86 22.78,24.86 24.39,23.25 v24.75,23.25
MUX_2_16  (via drill 0.4)
  Top 0.152: R_CAL.2 3.95,16.8 | 3.95,16.8 4.4,17.25 v10.25,17.25 | TP3.1 3.75,17 3.95,16.8
  Bottom 0.152: v10.25,17.25 10.5,17.5 11.75,17.5 12.05,17.8 U2.4
MUX_2_SEL_0  (via drill 0.4)
  Top 0.152: v27.25,19 27.25,30.25 23.99,33.51 J3.7
  Bottom 0.152: U2.17 22.21,13.96 v27.25,19
MUX_2_SEL_1  (via drill 0.4)
  Top 0.152: J3.8 26.53,36 28.5,34.03 v28.5,19
  Bottom 0.152: U2.16 23.48,13.98 v28.5,19
MUX_2_SEL_2  (via drill 0.4)
  Top 0.152: J3.9 29.07,34.5 29.75,33.82 v29.75,19
  Bottom 0.152: U2.15 24.75,14.01 v29.75,19
MUX_2_SEL_3
  Bottom 0.152: U2.14 28.75,23.19 28.75,37.39 J3.10
N$3
  Top 0.256: U3.4 6.58,30.32 R_FB.2
N$16
  Top 0.152: D5.A 40.25,10.75 40.74,11.24 JP2.1 40.74,13.51 39.75,14.5 D4.A
N$17
  Top 0.152: R7.1 34.1,10.75 D5.C
N$18
  Top 0.152: R8.1 D4.C
N$19
  Top 0.152: D6.A R9.1
N$20
  Top 0.152: JP1.1 R9.2
SCL
  Top 0.152: J3.2 11.27,40.23 11.35,40.15 R2.1 18.2,34 U3.16
SDA
  Top 0.152: J3.1 6.85,38.35 R1.1 8.1,32.75 16.5,32.75 17.62,31.62 U3.15
SPI_MISO  (via drill 0.39)
  Top 0.152: U4.25 40.91,20.13 41.26,20.13 41.67,20.54 v42.96,20.54 | U7.4 43.75,26.65 v43.6,26.5
  Bottom 0.152: v42.96,20.54 42.96,20.96 43.26,21.26 43.26,23.25 43.26,25.22 43.41,25.37 43.41,26.31 v43.6,26.5
SPI_MISO_5V
  Top 0.152: U7.11 43.75,36 39.58,40.17 J6.3
SPI_MOSI  (via drill 0.39)
  Top 0.152: U4.26 40.91,20.63 41.26,20.63 41.98,21.35 v42.5,21.35 | v43,27.25 43,29.33 U7.3
  Bottom 0.152: v42.5,21.35 42.5,21.55 42.95,22 42.95,25.34 43.11,25.5 43.11,26 43,26.11 v43,27.25
SPI_MOSI_5V
  Top 0.152: U7.12 43.1,35.9 42.45,36.55 40.73,36.55 J6.2
SPI_SCLK  (via drill 0.39)
  Top 0.152: U4.24 40.91,19.63 42.9,19.63 43.27,20 v44,20 | U7.5 44.5,29.53 v44.5,31
  Bottom 0.152: v44.5,31 44.5,20.5 v44,20
SPI_SCLK_5V
  Top 0.152: U7.10 44.4,36.1 44,36.5 44,38.37 J6.4
SPI_SEL  (via drill 0.39)
  Top 0.152: U4.27 40.91,21.13 41.26,21.13 41.48,21.35 41.48,21.38 v42.35,22.25 | v42.02,27.5 42.02,27.77 42.5,28.25 42.5,29.38 U7.2
  Bottom 0.152: v42.35,22.25 42.05,22.55 42.05,23.5 42.05,25.34 41.89,25.5 41.89,26 42.02,26.13 v42.02,27.5
SPI_SEL_5V
  Top 0.152: U7.13 42.45,36.05 42.25,36.25 36.25,36.25 34.5,38 J6.1
TX_REF
  Top 0.152: U4.9 34.1,18.5 C6.1
TXN  (via drill 0.4)
  Top 0.152: D1.N R7.2 | R7.2 30.38,8.73 J7.4 29,5.87 J5.2 J5.1 | U4.14 36.87,17.09 36.87,16.74 36.38,16.25 v34,16.25 | R7.2 32.15,10.95 31.35,11.75 v30.75,11.75
  Bottom 0.152: v34,16.25 31.75,16.25 30.75,15.25 v30.75,11.75
TXP  (via drill 0.4)
  Top 0.152: D2.N R8.2 | U4.15 37.5,16.25 37,15.75 34.75,15.75 34.5,15.5 33.15,15.5 R8.2 | R8.2 32.15,15.35 v32,15.5 | J7.1 38.5,6.75 J5.21 J5.22
  Bottom 0.152: v32,15.5 35.5,12 35.5,9.75 J7.1
VCC
  Top 0.254: 35.5,3 35.75,3 36.5,3.75 J5.17 J5.18 | 35.5,3 49,3 52,6 52,18.5 53.5,20 53.5,23.75 52.5,24.75 S2.2 | 35.5,3 31.5,3 30.75,3.75 30.75,4.3 | 30.75,4.3 J5.6 | 30.75,4.3 J5.5
  Top 0.508: U6.1 48,33.38 48,26.75 50,24.75 S2.2
VIN
  Top 0.152: 7.07,24 J2.1
  Top 0.256: VIN.1 3.89,24 7.07,24
  Bottom 0.256: U2.28 7.7,9.8 7,10.5 7,23.93 J2.1
VIN_AD
  Top 0.256: R_FB.1 4.08,27.37 J2.2 5.99,27.49 8.18,29.68 U3.5
VOUT  (via drill 0.4)
  Top 0.256: U3.6 10.03,29.02 v9.5,28.5 10.5,27.5 10.5,25.5 8.24,23.25 U1.28
  Bottom 0.256: VOUT.1 2.2,28.5 v9.5,28.5
XIN
  Top 0.152: C3.1 32.6,26.25 34.1,26.25 Q1.1 33.75,26.75 36.5,24 U4.38
XOUT
  Top 0.152: U4.37 37,24 39.75,26.75 Q1.2 39.75,27.6 C4.1

### Text on the board
tPlace: SCL SDA | MUX 1 / 3-2-1-0 | MUX 2 / 3-2-1-0 | SEL | MOSI | SPI | MISO | SCK | NextFlex / Rev A / S. Ono | RED | NIR | E15 | E1
bStop: Arias Research Group